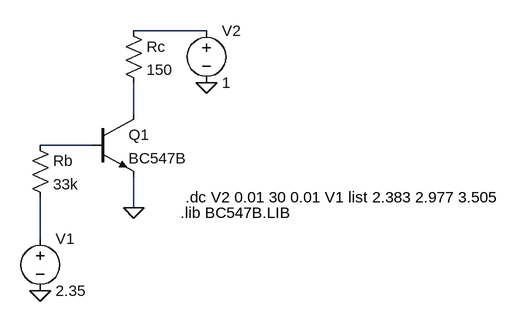
[diagram p0: schematic simulacion_transistor.asc]
simulacion_transistor.asc, the LTspice schematic file:
Version 4
SHEET 1 880 680
WIRE 304 -16 192 -16
WIRE 192 112 192 64
WIRE 128 160 48 160
WIRE 192 256 192 208
WIRE 48 304 48 240
FLAG 192 256 0
FLAG 304 64 0
FLAG 48 384 0
SYMBOL npn 128 112 R0
SYMATTR InstName Q1
SYMATTR Value BC547B
SYMBOL res 32 144 R0
SYMATTR InstName Rb
SYMATTR Value 33k
SYMBOL res 176 -32 R0
SYMATTR InstName Rc
SYMATTR Value 150
SYMBOL voltage 48 288 R0
SYMATTR InstName V1
SYMATTR Value 2.35
SYMBOL voltage 304 -32 R0
SYMATTR InstName V2
SYMATTR Value 1
TEXT 272 240 Left 2 !.dc V2 0.01 30 0.01 V1 list 2.383 2.977 3.505
TEXT 264 264 Left 2 !.lib BC547B.LIB

The netlist it stands for:
* simulacion_transistor.asc
Q1 N002 N003 0 0 BC547B
Rb N003 N004 33k
Rc N001 N002 150
V1 N004 0 2.35
V2 N001 0 1
.model NPN NPN
.model PNP PNP
.lib standard.bjt
.dc V2 0.01 30 0.01 V1 list 2.383 2.977 3.505
.lib BC547B.LIB
.backanno
.end